# EAGLE design Qwiic PHT Sensor - MS8607 (EAGLE 9.4.1)
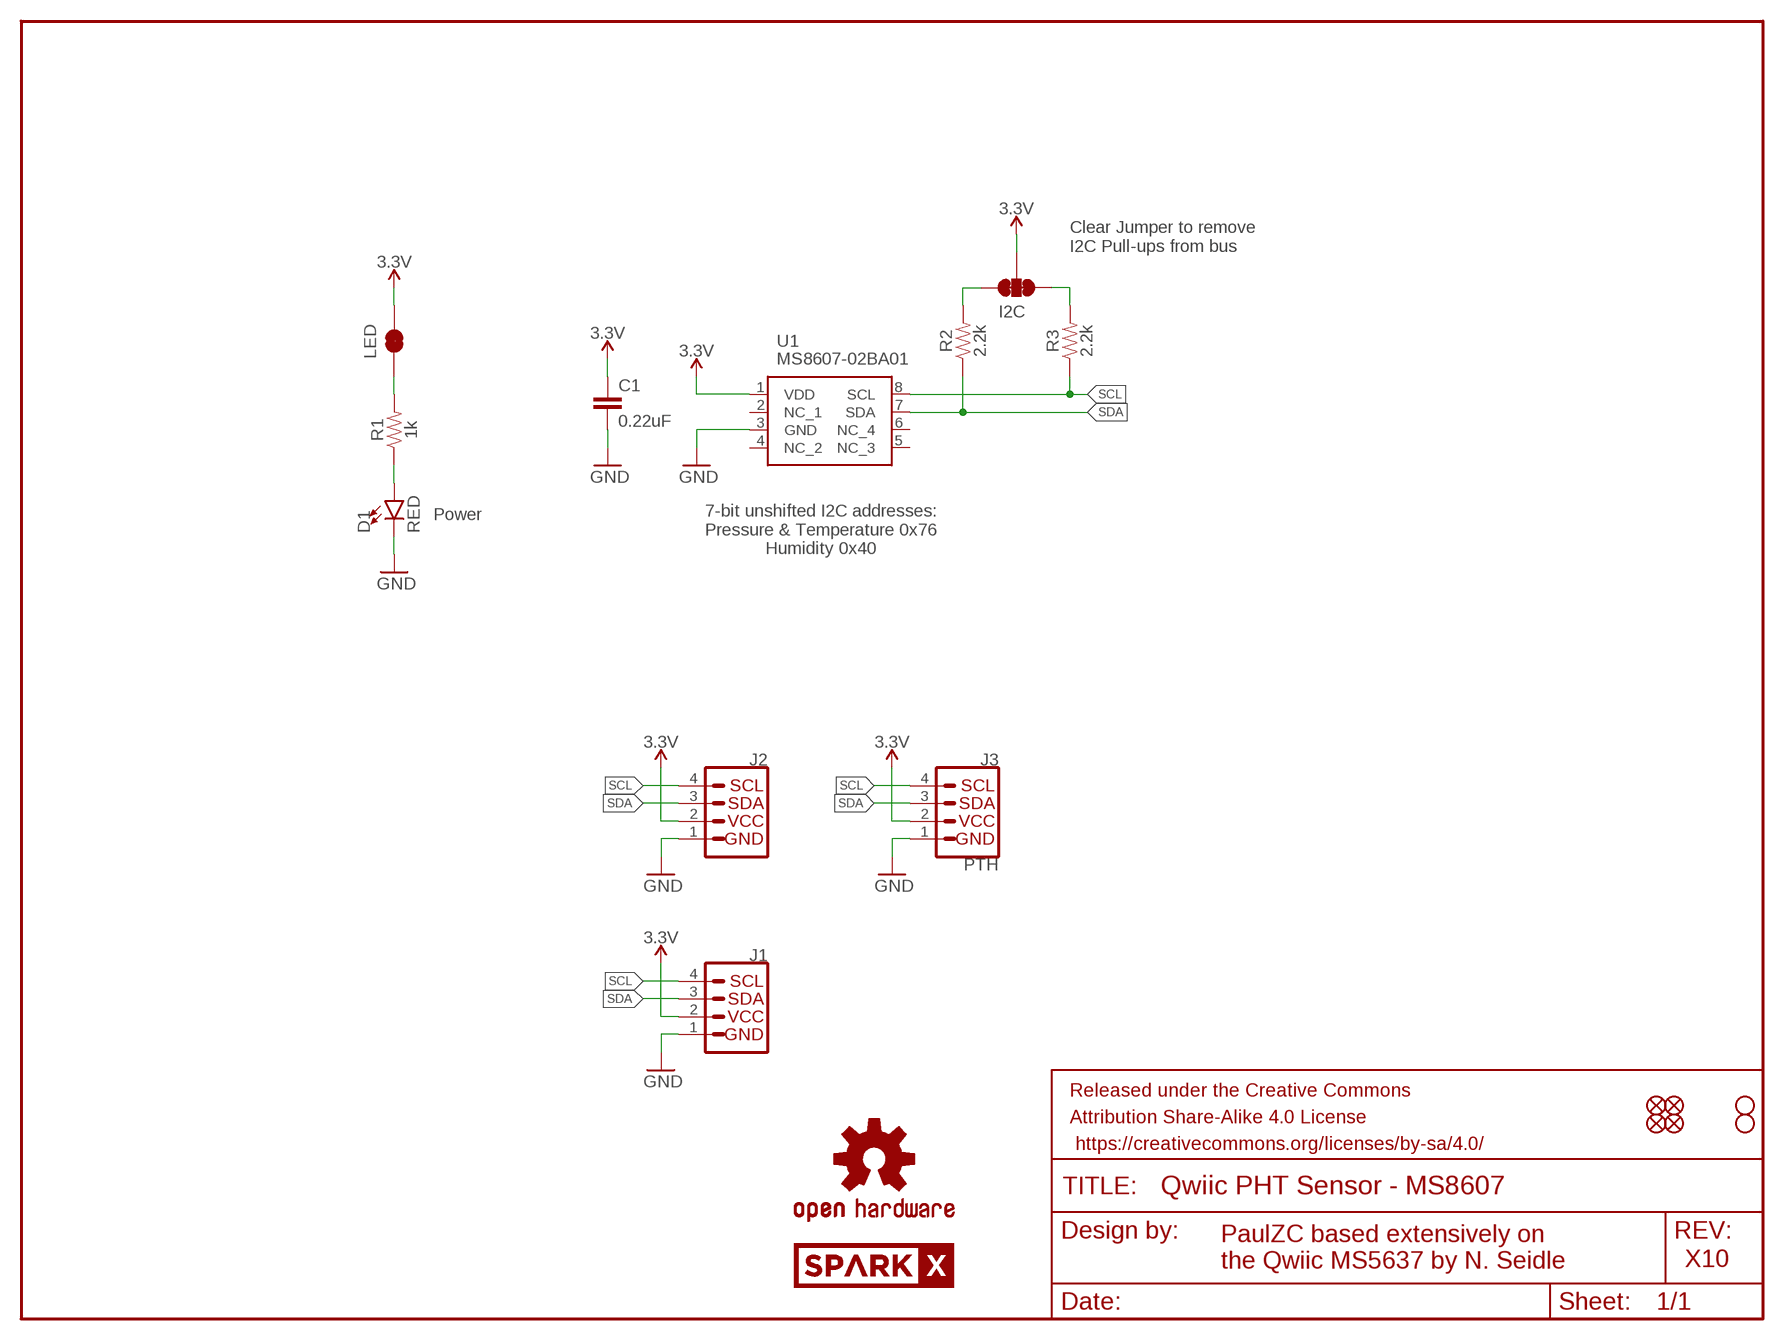
[diagram p0: schematic, sheet 1]

## Parts
C1  0.22uF  0.22UF-0603-25V-10%  [0603]
D1  RED  LED-RED0603  [LED-0603]
FRAME1  FRAME-LETTER  [CREATIVE_COMMONS]
I2C  JUMPER-SMT_3_2-NC_TRACE_SILK  [SMT-JUMPER_3_2-NC_TRACE_SILK]
J1  I2C_STANDARDQWIIC  [1X04_1MM_RA]
J2  I2C_STANDARDQWIIC  [1X04_1MM_RA]
J3  PTH  I2C_STANDARD_NO_SILK  [1X04_NO_SILK]
JP1  FIDUCIALUFIDUCIAL  [MICRO-FIDUCIAL]
JP2  FIDUCIALUFIDUCIAL  [MICRO-FIDUCIAL]
JP3  STAND-OFF  [STAND-OFF]
JP4  STAND-OFF  [STAND-OFF]
JP5  FIDUCIALUFIDUCIAL  [MICRO-FIDUCIAL]
JP6  FIDUCIALUFIDUCIAL  [MICRO-FIDUCIAL]
LED  JUMPER-SMT_2_NC_TRACE_SILK  [SMT-JUMPER_2_NC_TRACE_SILK]
LOGO1  OSHW-LOGOMINI  [OSHW-LOGO-MINI]
R1  1k  1KOHM-0603-1/10W-1%  [0603]
R2  2.2k  2.2KOHM-0603-1/10W-1%  [0603]
R3  2.2k  2.2KOHM-0603-1/10W-1%  [0603]
U1  MS8607-02BA01  [MS8607-02BA01]
U$1  SPARKX-LOGO4  [SPARKX-MEDIUM]
U$2  SPARKX-LOGO4  [SPARKX-MEDIUM]

## Nets
3.3V: C1.1 I2C.2 J1.2 J2.2 J3.2(VCC) LED.2 U1.1(VDD)
GND: C1.2 D1.C J1.1 J2.1 J3.1(GND) U1.3(GND)
N$1: I2C.1 R3.2
N$2: I2C.3 R2.2
N$3: D1.A R1.1
N$4: LED.1 R1.2
SCL: J1.4 J2.4 J3.4(SCL) R3.1 U1.8(SCL)
SDA: J1.3 J2.3 J3.3(SDA) R2.1 U1.7(SDA)
Unconnected: U1.2(NC_1) U1.4(NC_2) U1.5(NC_3) U1.6(NC_4)

## Notes on the sheet
- Clear Jumper to remove 
  I2C Pull-ups from bus
- Power
- 7-bit unshifted I2C addresses:
  Pressure & Temperature 0x76
  Humidity 0x40
- X10
- PaulZC based extensively on
  the Qwiic MS5637 by N. Seidle

## Library data of the parts
C1 = SparkFun-Capacitors:0.22UF: 0.22µF ceramic capacitors A capacitor is a passive two-terminal electrical component used to store electrical energy temporarily in an electric field.; PROD_ID: CAP-07822
D1 = SparkFun-LED:LED-RED: Red SMD LED Used in manufacturing of most products at SparkFun Packages: 0603 - SMD 0603 package [Product Link] <http://docs.avagotech.com/docs/AV02-0551EN> 0603 SMART - SMD 0603 SMART package ( more efficient and expensive)[Product Link] <http://www.osram-os.com/Graphics/XPic2/00077099_0.pdf> 1206 - SMD1206 package [Product Link] <https://www.sparkfun.com/datasheets/DevTools/LilyPad/Q150OVS4.pdff> SparkFun Products: Pro Mini 328 -5V <https://www.sparkfun.com/products/821> RedBoard <https://www.sparkfun.com/products/12757> IOIO-OTG <https://www.sparkfun.com/products/13613>; PROD_ID: DIO-00819
FRAME1 = SparkFun-Aesthetics:FRAME-LETTER: Schematic Frame - Letter Standard 8.5x11 US Letter frame
I2C = SparkFun-Jumpers:JUMPER-SMT_3_2-NC_TRACE: Normally closed trace jumper (2 of 2 connections) This jumper has a trace between all three pads so they are normally closed (NC). Use a razor knife to open the connection(s). For best results follow the IPC guidelines for cutting traces: Cutout at least 0.063 mm (0.005 in). Remove all loose material to clean up the cut area. Seal the cut with an approved epoxy. Reapply solder to reclose the connection(s).
J1 J2 = SparkFun-Connectors:I2C_STANDARD: SparkFun I2C Standard Pinout Header SparkFun has standardized on a pinout for all I2C based sensor breakouts. This pinout allows I2C boards to be plugged directly into the headers on Arduino Uno compatible boards, and to be daisy chained easily. Example SparkFun Products: SparkFun Atmospheric Sensor Breakout - BME280 <https://www.sparkfun.com/products/13676> SparkFun Altitude/Pressure Sensor Breakout - MPL3115A2 <https://www.sparkfun.com/products/11084> SparkFun TOF Range Finder Sensor - VL6180 <https://www.sparkfun.com/products/12785>; PROD_ID: CONN-13694; VALUE: Qwiic Right Angle
J3 = SparkX:I2C_STANDARD: SparkFun I2C Standard Pinout Header SparkFun has standardized on a pinout for all I2C based sensor breakouts. This pinout allows I2C boards to be plugged directly into the headers on Arduino Uno compatible boards, and to be daisy chained easily. Example SparkFun Products: SparkFun Atmospheric Sensor Breakout - BME280 <https://www.sparkfun.com/products/13676> SparkFun Altitude/Pressure Sensor Breakout - MPL3115A2 <https://www.sparkfun.com/products/11084> SparkFun TOF Range Finder Sensor - VL6180 <https://www.sparkfun.com/products/12785>
JP1 JP2 JP5 JP6 = SparkFun:FIDUCIAL: Fiducial Alignment Points Various fiducial points for machine vision alignment.
JP3 JP4 = SparkFun:STAND-OFF: Stand Off This is the mechanical footprint for a #4 phillips button head screw. Use the keepout ring to avoid running the screw head into surrounding components. SKU : PRT-00447
LED = SparkFun-Jumpers:JUMPER-SMT_2_NC_TRACE: Normally closed trace jumper This jumper has a trace between two pads so it's normally closed (NC). Use a razor knife to open the connection. For best results follow the IPC guidelines for cutting traces: Cutout at least 0.063 mm (0.005 in). Remove all loose material to clean up the cut area. Seal the cut with an approved epoxy. Reapply solder to reclose the connection.
LOGO1 = SparkFun-Aesthetics:OSHW-LOGO: Open-Source Hardware (OSHW) Logo This logo indicates the piece of hardware it is found on incorporates a OSHW license and/or adheres to the definition of open source hardware found here: http://freedomdefined.org/OSHW
R1 = SparkFun-Resistors:1KOHM: 1kΩ resistor A resistor is a passive two-terminal electrical component that implements electrical resistance as a circuit element. Resistors act to reduce current flow, and, at the same time, act to lower voltage levels within circuits. - Wikipedia; PROD_ID: RES-07856
R2 R3 = SparkFun-Resistors:2.2KOHM: 2.2kΩ resistor A resistor is a passive two-terminal electrical component that implements electrical resistance as a circuit element. Resistors act to reduce current flow, and, at the same time, act to lower voltage levels within circuits. - Wikipedia; PROD_ID: RES-08272
U1 = SamacSys_Parts:MS8607-02BA01: PHT Combination Sensor Source: Datasheet <http://www.te.com/commerce/DocumentDelivery/DDEController?Action=showdoc&DocId=Data SheetMS8607-02BA01BpdfEnglishENG_DS_MS8607-02BA01_B.pdfCAT-BLPS0018>; DESCRIPTION: PHT Combination Sensor; HEIGHT: mm; MANUFACTURER_NAME: TE Connectivity; MANUFACTURER_PART_NUMBER: MS8607-02BA01
U$1 U$2 = SparkX:SPARKX-LOGO

## Net classes
1 power: width 0.203 mm

## Board
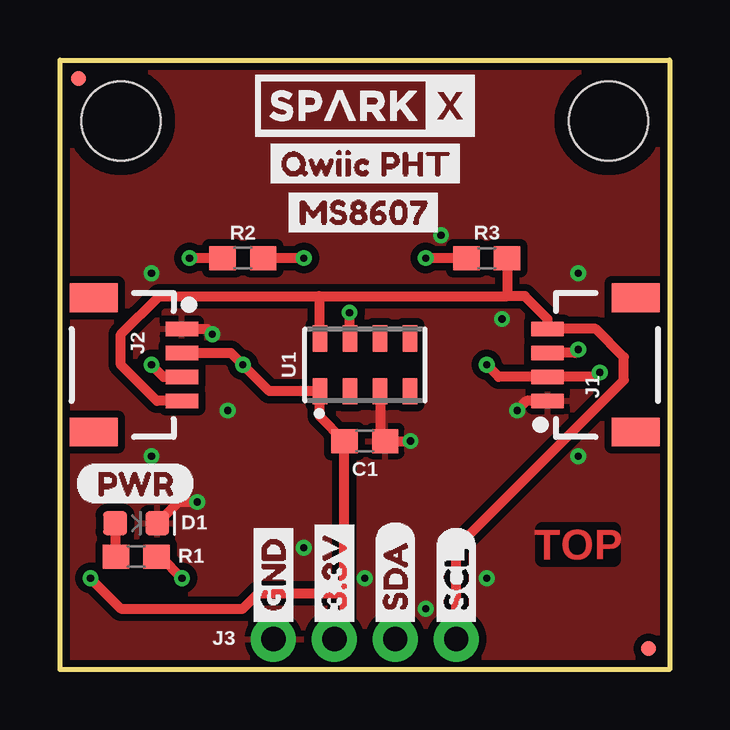
[diagram p1: board, top side]
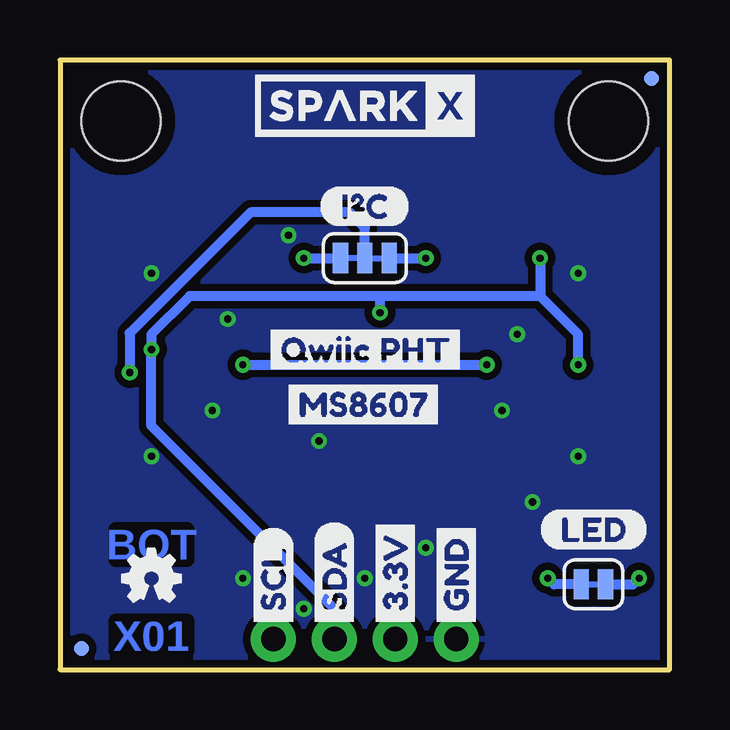
[diagram p2: board, bottom side, seen from below]

Size 25.4 x 25.4 mm. Coordinates in mm from the lower left corner, seen from the top.
Outline: 0,0 0,25.4 25.4,25.4 25.4,0 0,0
Copper layers (1*16): Top 0.035mm / dielectric 1.5mm / Bottom 0.035mm
Design rules "SparkFun-2-layer-PCBWay-LIMIT": minimum track width 6mil, minimum drill 0.3mm, track to track 6mil, track to pad 6mil, pad to pad 6mil, via to via 6mil, smd to smd 6mil, copper to edge 6mil, drill to drill 6mil, minimum pad ring 7mil, minimum via ring 7mil, stop-mask expansion 4mil, vias tented up to drill 25mil, thermal gap 10mil

### Footprints (pad centres in the part's own frame; a part is rotated, then mirrored left to right if it is on the bottom)
0603 = smd 1.1 x 1: 1 -0.85,0; 2 0.85,0
LED-0603 = smd 1 x 1: A -0.877,0; C 0.877,0
SMT-JUMPER_3_2-NC_TRACE_SILK = smd 0.635 x 1.27: 1 -1.016,0; 2 0,0; 3 1.016,0
1X04_1MM_RA = smd 0.6 x 1.35: 1 -1.5,0; 2 -0.5,0; 3 0.5,0; 4 1.5,0 | smd 1.2 x 2: NC1 2.8,-3.675; NC2 -2.8,-3.675
1X04_NO_SILK = drill 1.016 pad 1.88: 1 0,0; 2 2.54,0; 3 5.08,0; 4 7.62,0
MICRO-FIDUCIAL = smd 0.635 x 0.635: 1 0,0
STAND-OFF = hole 3.302: 0,0
SMT-JUMPER_2_NC_TRACE_SILK = smd 0.635 x 1.27: 1 -0.508,0; 2 0.508,0
MS8607-02BA01 = smd 1.1 x 0.6: 1 -1.1,1.875; 2 -1.1,0.625; 3 -1.1,-0.625; 4 -1.1,-1.875; 5 1.1,-1.875; 6 1.1,-0.625; 7 1.1,0.625; 8 1.1,1.875

### Placement (x,y rotation side)
C1  12.7,9.53 0 top
D1  3.17,6.1 0 top
FRAME1  -20.32,-17.78 0 top  (outside the outline)
I2C  12.7,17.14 0 bottom
J1  20.32,12.7 90 top
J2  5.08,12.7 270 top
J3  8.89,1.27 0 top
JP1  0.76,24.64 0 bottom
JP2  24.51,0.89 0 top
JP3  2.54,22.86 0 top
JP4  22.86,22.86 0 top
JP5  24.51,0.89 0 bottom
JP6  0.76,24.64 0 top
LED  3.17,3.56 0 bottom
LOGO1  21.59,3.81 0 bottom
R1  3.17,4.7 0 top
R2  7.62,17.14 0 top
R3  17.78,17.14 180 top
U1  12.7,12.7 90 top
U$1  12.7,23.5 0 top
U$2  12.7,23.5 0 bottom
U$3  [GND1]  8.89,1.52 90 bottom
U$4  [3#3V2]  11.43,1.52 90 bottom
U$5  [SDA8]  13.97,1.52 90 bottom
U$6  [SCL9]  16.51,1.52 90 bottom
U$9  [QWIIC_PHT0]  8.26,21.08 0 top
U$10  [(PWR)]  0.64,7.75 0 top
U$11  [(I_SUPER2_C)]  14.61,19.3 0 bottom
U$12  [QWIIC_PHT0]  17.14,13.34 0 bottom
U$15  [MS86070]  9.02,19.05 0 top
U$16  [MS86070]  16.38,11.05 0 bottom
U$17  [LED0]  5.46,5.84 0 bottom
U$21  [3#3V2]  11.43,1.52 90 top
U$22  [GND1]  8.89,1.52 90 top
U$26  [SCL9]  16.51,1.52 90 top
U$27  [SDA8]  13.97,1.52 90 top

### Tracks (layer width: path | path; a pad name or v marks a point on that pad's centre or on a via)
3.3V  (via drill 0.3)
  Top 0.406: 11.85,3.17 11.85,1.69 J3.2 | 11.85,3.17 C1.1 10.82,10.55 U1.1 8.72,11.6 v7.62,12.7 7.12,13.2 J2.2 | v17.78,12.7 18.28,12.2 J1.2 22.31,12.2 v22.49,12.38 | v1.27,3.81 2.54,2.54 7.62,2.54 8.26,3.17 11.85,3.17
  Bottom 0.406: v17.78,12.7 v7.62,12.7 | LED.2 1.52,3.56 v1.27,3.81 | I2C.2 12.7,18.41 13.34,19.05 17.46,19.05 22.49,14.02 v22.49,12.38
GND  (via drill 0.3)
  Top 0.406: J2.1 6.12,14.2 v6.35,13.97 | J1.1 19.45,11.2 v19.05,10.79 | v14.61,9.53 C1.2 13.34,9.74 13.34,11.59 U1.3 | D1.C 4.94,6.99 v5.71,6.99
  other vias: 12.7,3.81 10.16,5.08 15.24,2.54 17.78,3.81 21.59,8.89 21.59,16.51 3.81,16.51 3.81,8.89 15.88,18.1 6.99,10.79 18.41,14.61
  pour Bottom (isolate 0.305): 0,0 0,25.4 25.4,25.4 25.4,0
  pour Top (isolate 0.305): 0,0 0,25.4 25.4,25.4 25.4,0
N$1  (via drill 0.3)
  Top 0.406: R3.2 v15.24,17.14
  Bottom 0.406: v15.24,17.14 I2C.1
N$2  (via drill 0.3)
  Top 0.406: v10.16,17.14 R2.2
  Bottom 0.406: I2C.3 v10.16,17.14
N$3
  Top 0.152: 2.3,4.73 R1.1
  Top 0.406: D1.A 2.3,4.73
N$4  (via drill 0.3)
  Top 0.406: R1.2 4.19,4.7 v5.08,3.81
  Bottom 0.406: LED.1 4.83,3.56 v5.08,3.81
SCL
  Top 0.406: J3.4 16.51,5.08 23.5,12.06 23.5,13.02 22.31,14.2 J1.4 20.32,14.61 19.37,15.56 18.63,15.56 | 10.79,15.56 4.13,15.56 2.54,13.97 2.54,12.7 4.04,11.2 J2.4 | 10.79,15.56 18.63,15.56 | R3.1 18.63,15.56 | U1.8 10.82,15.53 10.79,15.56
SDA  (via drill 0.3)
  Top 0.406: J2.3 4.31,12.2 v3.81,12.7 | v21.59,13.34 21.45,13.2 J1.3 | R2.1 v5.4,17.14 | U1.7 12.07,14.86 v12.06,14.87
  Bottom 0.406: v3.81,12.7 3.81,13.97 5.4,15.56 | 5.4,15.56 12.06,15.56 | 12.06,15.56 20,15.56 21.59,13.97 v21.59,13.34 21.59,10.16 13.97,2.54 J3.3 | v5.4,17.14 5.4,15.56 | v12.06,14.87 12.06,15.56

### Text on the board
Top: TOP
Bottom: BOT | X01